# EAGLE design lp50xx-breakout (EAGLE 9.6.2)
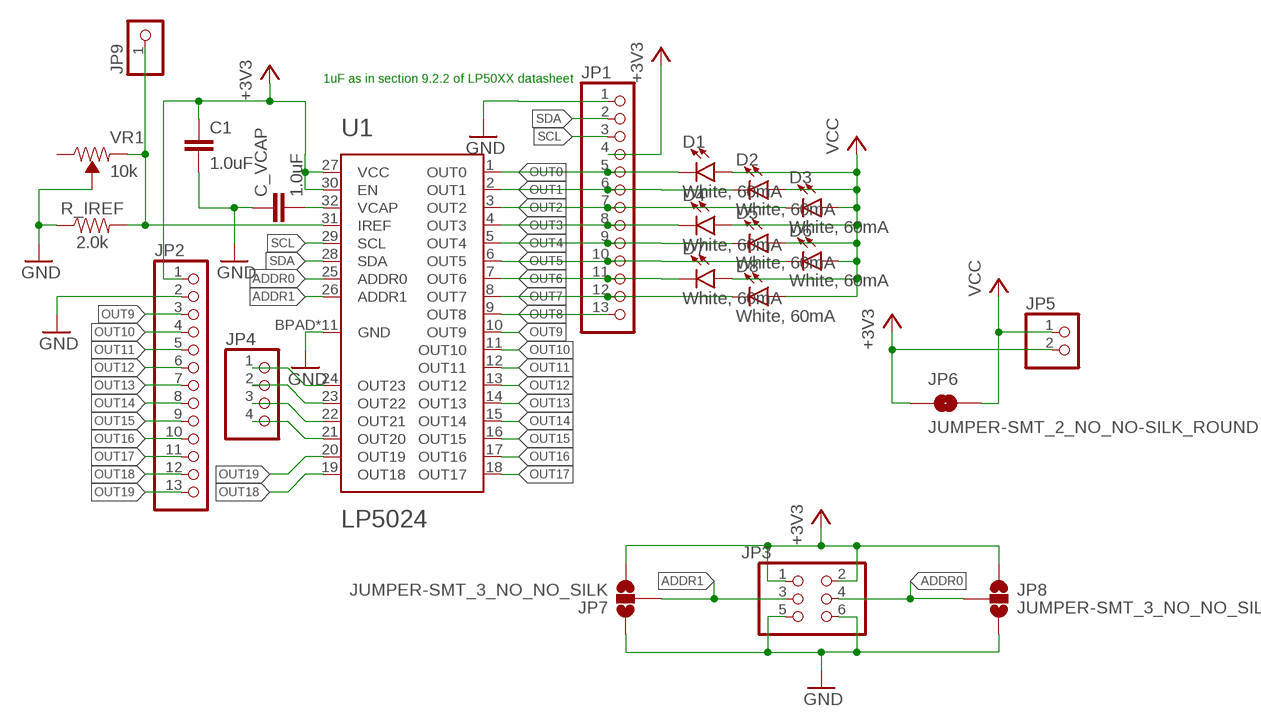
[diagram p0: schematic, sheet 1]

## Parts
C1  1.0uF  1.0UF-0603-16V-10%  [0603]
C_VCAP  1.0uF  1.0UF-0603-16V-10%  [0603]
D1  White, 60mA  LED-WHITE3014  [SUPER_BRIGHT_SMD_LED_3014]
D2  White, 60mA  LED-WHITE3014  [SUPER_BRIGHT_SMD_LED_3014]
D3  White, 60mA  LED-WHITE3014  [SUPER_BRIGHT_SMD_LED_3014]
D4  White, 60mA  LED-WHITE3014  [SUPER_BRIGHT_SMD_LED_3014]
D5  White, 60mA  LED-WHITE3014  [SUPER_BRIGHT_SMD_LED_3014]
D6  White, 60mA  LED-WHITE3014  [SUPER_BRIGHT_SMD_LED_3014]
D7  White, 60mA  LED-WHITE3014  [SUPER_BRIGHT_SMD_LED_3014]
D8  White, 60mA  LED-WHITE3014  [SUPER_BRIGHT_SMD_LED_3014]
JP1  PINHD-1X13  [1X13]
JP2  PINHD-1X13  [1X13]
JP3  PINHD-2X3  [2X03]
JP4  PINHD-1X4  [1X04]
JP5  PINHD-1X2  [1X02]
JP6  JUMPER-SMT_2_NO_NO-SILK_ROUND  [SMT-JUMPER_2_NO_NO-SILK_ROUND]
JP7  JUMPER-SMT_3_NO_NO_SILK  [SMT-JUMPER_3_0-NO_TRACE_NO-SILK]
JP8  JUMPER-SMT_3_NO_NO_SILK  [SMT-JUMPER_3_0-NO_TRACE_NO-SILK]
JP9  PINHD-1X1  [1X01]
R_IREF  2.0k  2.0KOHM-0603-1/10W-5%  [0603]
U1  LP5024  [S-PVQFN-N32]
VR1  10k  TRIMPOT-SMD-3MM-CLOSED-1/8W-20%  [TRIMPOT-SMD-3MM-CLOSED]

## Nets
+3V3: C1.1 JP1.4 JP2.1 JP3.1 JP3.2 JP5.2 JP6.1 JP7.3 JP8.1 U1.27(VCC) U1.30(EN)
ADDR0: JP3.4 JP8.2 U1.25(ADDR0)
ADDR1: JP3.3 JP7.2 U1.26(ADDR1)
GND: C1.2 C_VCAP.1 JP1.1 JP2.2 JP3.5 JP3.6 JP7.1 JP8.3 R_IREF.1 U1.BPAD(GND) U1.EVIA@1(GND) U1.EVIA@2(GND) U1.EVIA@3(GND) U1.EVIA@4(GND) U1.EVIA@5(GND) U1.EVIA@6(GND) U1.EVIA@7(GND) U1.EVIA@8(GND) U1.EVIA@9(GND) U1.TPAD(GND) VR1.2(WIPER)
IREF: JP9.1 R_IREF.2 U1.31(IREF) VR1.1(CCW)
OUT0: D1.C JP1.5 U1.1(OUT0)
OUT1: D2.C JP1.6 U1.2(OUT1)
OUT2: D3.C JP1.7 U1.3(OUT2)
OUT3: D4.C JP1.8 U1.4(OUT3)
OUT4: D5.C JP1.9 U1.5(OUT4)
OUT5: D6.C JP1.10 U1.6(OUT5)
OUT6: D7.C JP1.11 U1.7(OUT6)
OUT7: D8.C JP1.12 U1.8(OUT7)
OUT8: JP1.13 U1.9(OUT8)
OUT9: JP2.3 U1.10(OUT9)
OUT10: JP2.4 U1.11(OUT10)
OUT11: JP2.5 U1.12(OUT11)
OUT12: JP2.6 U1.13(OUT12)
OUT13: JP2.7 U1.14(OUT13)
OUT14: JP2.8 U1.15(OUT14)
OUT15: JP2.9 U1.16(OUT15)
OUT16: JP2.10 U1.17(OUT16)
OUT17: JP2.11 U1.18(OUT17)
OUT18: JP2.12 U1.19(OUT18)
OUT19: JP2.13 U1.20(OUT19)
OUT20: JP4.4 U1.21(OUT20)
OUT21: JP4.3 U1.22(OUT21)
OUT22: JP4.2 U1.23(OUT22)
OUT23: JP4.1 U1.24(OUT23)
SCL: JP1.3 U1.29(SCL)
SDA: JP1.2 U1.28(SDA)
VCAP: C_VCAP.2 U1.32(VCAP)
VCC: D1.A D2.A D3.A D4.A D5.A D6.A D7.A D8.A JP5.1 JP6.2
Unconnected: VR1.3(CW)

## Notes on the sheet
- 1uF as in section 9.2.2 of LP50XX datasheet

## Library data of the parts
C1 C_VCAP = SparkFun-Capacitors:1.0UF: 1µF ceramic capacitors A capacitor is a passive two-terminal electrical component used to store electrical energy temporarily in an electric field.; PROD_ID: CAP-00868
D1-D8 = SparkFun-LED-otto:LED-WHITE: White SMD LED Used in manufacturing several products at SparkFun. Packages: 0603 - Bright White SMD 0603 package[Product Link] <http://www.kingbrightusa.com/product.asp?catalog_name=LED&product_id=APT1608QWF/D> 1206 - Bright White SMD1206 package [Product Link] <http://www.kingbrightusa.com/product.asp?catalog_name=LED&product_id=APT3216QWF/D> 3014 - Super Bright SMD 3014 package [Datasheet] <http://www.lumileds.com/uploads/459/DS208-pdf> SparkFun Products: Blackberry Trackballer Breakout <https://www.sparkfun.com/products/13169> Digital SandBox <https://www.sparkfun.com/products/12651>; PROD_ID: DIO-13728
JP1 JP2 = pinhead-otto:PINHD-1X13: PIN HEADER
JP3 = pinhead-otto:PINHD-2X3: PIN HEADER
JP4 = pinhead-otto:PINHD-1X4: PIN HEADER
JP5 = pinhead-otto:PINHD-1X2: PIN HEADER
JP6 = SparkFun-Jumpers:JUMPER-SMT_2_NO: Normally open jumper This jumper has two pads in close proximity to each other. Apply solder to close the connection. Round pads are easier to solder for beginners, but are a lot larger. SparkFun Product that uses the round pads: SparkFun EL Sequencer <https://www.sparkfun.com/products/12781>
JP7 JP8 = SparkFun-Jumpers:JUMPER-SMT_3_NO: Normally open jumper This jumper has three pads in close proximity to each other. Apply solder to close the connection(s).
JP9 = pinhead-otto:PINHD-1X1: PIN HEADER
R_IREF = SparkFun-Resistors:2.0KOHM: 2kΩ resistor A resistor is a passive two-terminal electrical component that implements electrical resistance as a circuit element. Resistors act to reduce current flow, and, at the same time, act to lower voltage levels within circuits. - Wikipedia; PROD_ID: RES-08296
U1 = lp50xx:LP5024
VR1 = SparkFun-Resistors:TRIMPOT: Trimming Potentiometer (Trimpot) Three-terminal potentiometers, with an adjustable wiper and two adjustable resistors. A pot can be used to create a configurable voltage divider, or as a variable resistor. "Trimpots" are a subset of potentiometers, usually intended for "set-and-forget" applications. They're often more delicate than standard potentiometers - rated for fewer turns. Variants PTH-KNOB - PTH Trimpot w/ finger-adjustable knob Trimpot 10K with Knob <https://www.sparkfun.com/products/9806> (COM-09806) Datasheet <http://www.sparkfun.com/datasheets/Components/General/TSR-3386.pdf> SMD-3MM-CLOSED-FRAME - SMD 3mm Square Closed-Frame Trimpot Used on e.g. EasyDriver - Stepper Motor Driver <https://www.sparkfun.com/products/12779> Datasheet <http://www.bitechnologies.com/pdfs/22.pdf> (22AR10KTR) SMD-5MM - SMD 5mm Square Closed-Frame Trimpot Used on e.g. IOIO-OTG - V2.2 <https://www.sparkfun.com/products/13613> Datasheet <http://www.vishay.com/docs/51008/ts53.pdf> (TS53YL502MR10) SMD-3MM-1/10W-25% - 3mm Square Open-Frame Trimpot Used on e.g. SparkFun Shapeoko <https://www.sparkfun.com/products/13899> Datasheet <http://www.bourns.com/docs/Product-Datasheets/TC33.pdf> (TC33X-2-103E); PROD_ID: RES-09285

## Net classes
0 default: clearance 0.205 mm

## Board
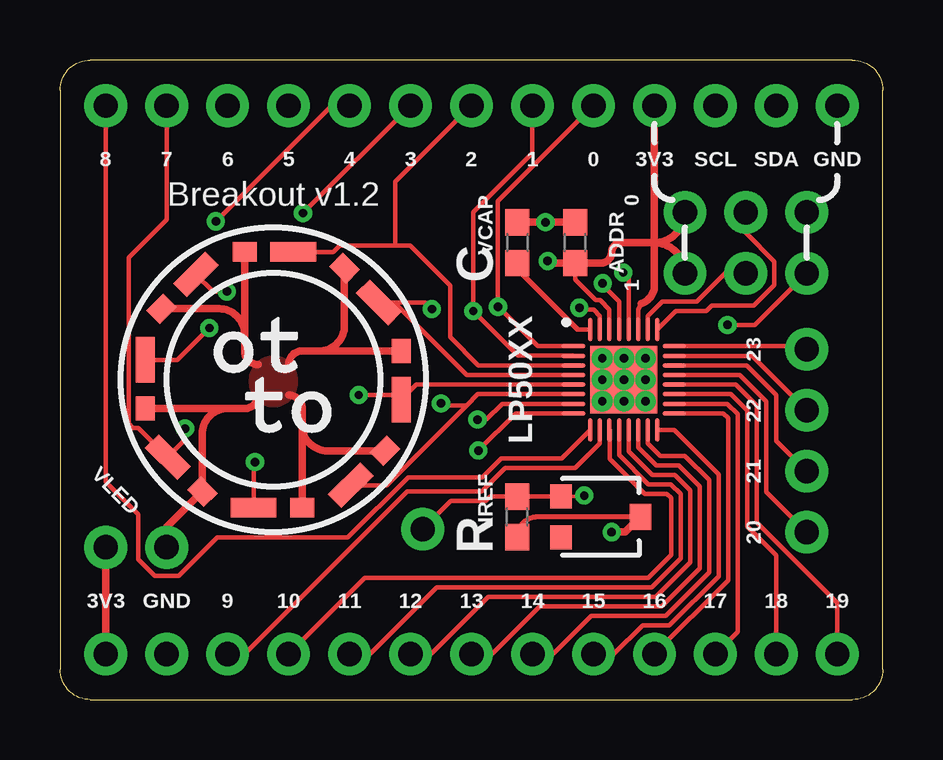
[diagram p1: board, top side]
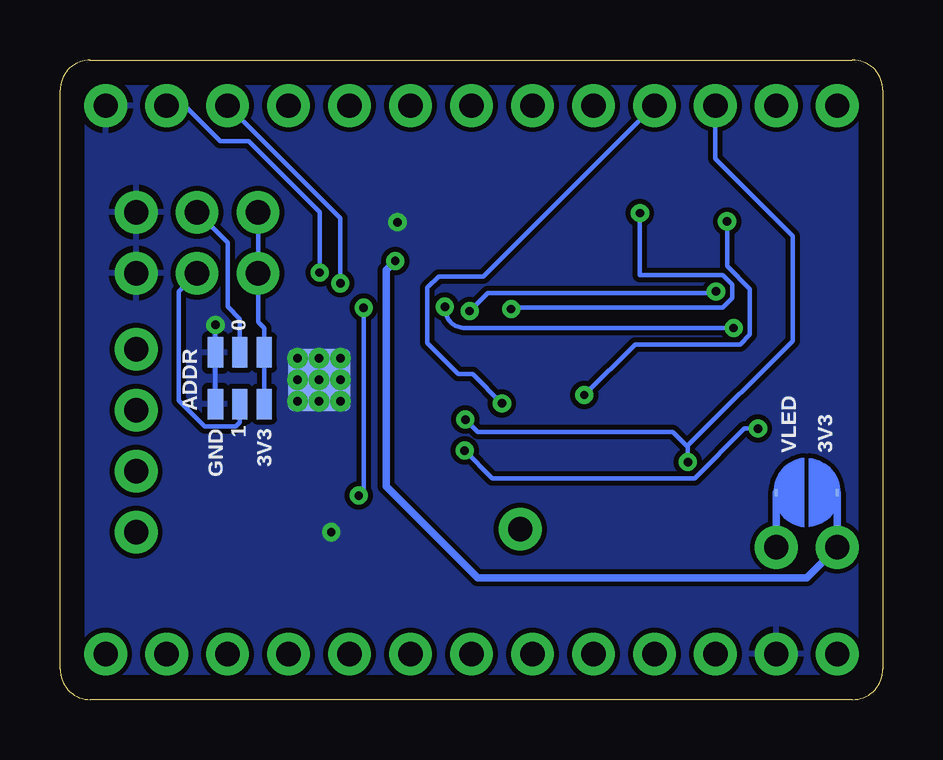
[diagram p2: board, bottom side, seen from below]

Size 34.29 x 26.67 mm. Coordinates in mm from the lower left corner, seen from the top.
Outline: 1.27,0 33.02,0 arc90 34.29,1.27 34.29,25.4 arc90 33.02,26.67 1.27,26.67 arc90 0,25.4 0,1.27 arc90 1.27,0
Copper layers (1*16): Top 0.035mm / dielectric 1.5mm / Bottom 0.035mm
Design rules "default *": minimum track width 6mil, minimum drill 0.3mm, track to track 6mil, track to pad 6mil, pad to pad 6mil, via to via 6mil, smd to smd 0mil, copper to edge 40mil, drill to drill 6mil, minimum pad ring 10mil, minimum via ring 8mil, stop-mask expansion 4mil, vias tented up to drill 15mil, thermal gap 10mil

### Footprints (pad centres in the part's own frame; a part is rotated, then mirrored left to right if it is on the bottom)
0603 = smd 1.1 x 1: 1 -0.85,0; 2 0.85,0
SUPER_BRIGHT_SMD_LED_3014 = smd 1 x 0.8: A -1.2,0 | smd 1.9 x 0.8: C 0.827,0
1X13 = drill 1.016 pad 1.778: 1 -15.24,0; 2 -12.7,0; 3 -10.16,0; 4 -7.62,0; 5 -5.08,0; 6 -2.54,0; 7 0,0; 8 2.54,0; 9 5.08,0; 10 7.62,0; 11 10.16,0; 12 12.7,0; 13 15.24,0
2X03 = drill 1.016 pad 1.778: 1 -2.54,-1.27; 2 -2.54,1.27; 3 0,-1.27; 4 0,1.27; 5 2.54,-1.27; 6 2.54,1.27
1X04 = drill 1.016 pad 1.778: 1 -3.81,0; 2 -1.27,0; 3 1.27,0; 4 3.81,0
1X02 = drill 1.016 pad 1.778: 1 -1.27,0; 2 1.27,0
SMT-JUMPER_2_NO_NO-SILK_ROUND = smd 0.152 x 0.305: 1 -1.27,0; 2 1.27,0
SMT-JUMPER_3_0-NO_TRACE_NO-SILK = smd 0.635 x 1.27: 1 -1.016,0; 2 0,0; 3 1.016,0
1X01 = drill 1.016 pad 1.778: 1 0,0
S-PVQFN-N32 = smd 0.195 x 0.99: 1 -1.4,-2.1; 2 -1,-2.1; 3 -0.6,-2.1; 4 -0.2,-2.1; 5 0.2,-2.1; 6 0.6,-2.1; 7 1,-2.1; 8 1.4,-2.1; 17 1.4,2.1; 18 1,2.1; 19 0.6,2.1; 20 0.2,2.1; 21 -0.2,2.1; 22 -0.6,2.1; 23 -1,2.1; 24 -1.4,2.1 | smd 0.99 x 0.195: 9 2.1,-1.4; 10 2.1,-1; 11 2.1,-0.6; 12 2.1,-0.2; 13 2.1,0.2; 14 2.1,0.6; 15 2.1,1; 16 2.1,1.4; 25 -2.1,1.4; 26 -2.1,1; 27 -2.1,0.6; 28 -2.1,0.2; 29 -2.1,-0.2; 30 -2.1,-0.6; 31 -2.1,-1; 32 -2.1,-1.4 | smd 2.6 x 2.6 bottom: BPAD 0,0 | drill 0.35 pad 0.6: EVIA@1 -0.9,0.9; EVIA@2 0,0.9; EVIA@3 0.9,0.9; EVIA@4 -0.9,0; EVIA@5 0,0; EVIA@6 0.9,0; EVIA@7 -0.9,-0.9; EVIA@8 0,-0.9; EVIA@9 0.9,-0.9 | smd 2.8 x 2.8: TPAD 0,0
TRIMPOT-SMD-3MM-CLOSED = smd 1 x 0.9: 1 -0.85,-1.65; 3 0.85,-1.65 | smd 1.1 x 0.9: 2 0,1.65

### Placement (x,y rotation side)
C1  21.46,19.05 90 top
C_VCAP  19.05,19.05 270 top
D1  3.56,13.34 90 top
D2  5.08,17.14 45 top
D3  8.89,18.67 0 top
D4  12.7,17.14 315 top
D5  14.22,13.34 270 top
D6  12.7,9.53 225 top
D7  8.89,8 180 top
D8  5.08,9.53 135 top
JP1  17.14,24.77 180 top
JP2  17.14,1.91 0 top
JP3  28.57,19.05 0 top
JP4  31.11,10.79 270 top
JP5  3.17,6.35 180 top
JP6  3.17,8.64 180 bottom
JP7  26.8,12.32 0 bottom
JP8  26.8,14.48 180 bottom
JP9  15.11,7.11 0 top
R_IREF  19.05,7.62 90 top
U1  23.49,13.34 270 top
VR1  22.53,7.62 270 top

### Tracks (layer width: path | path; a pad name or v marks a point on that pad's centre or on a via)
+3V3  (via drill 0.35)
  Top 0.191: U1.30 22.89,16.27 22.51,16.66 22.33,16.66 21.46,17.52 C1.1 | U1.27 24.09,16.26 24.22,16.51
  Top 0.305: JP2.1 JP5.2 | JP3.2 arc-90 24.77,19.05 | 24.77,19.05 arc-90 JP3.1 | 24.77,19.05 23.37,19.05 arc90 22.99,18.67 arc-90 22.52,18.2 C1.1 20.41,18.2 v20.32,18.29 | JP1.4 24.77,19.05 | 24.77,19.05 24.77,17.27 arc-71 24.22,16.51
  Bottom 0.191: JP3.2 JP3.1 26.04,15.75 25.78,15.49 JP8.1 JP7.3
  Bottom 0.305: v20.32,18.29 20.7,17.91 20.7,8.89 16.89,5.08 3.17,5.08 JP5.2 JP6.1
ADDR0
  Top 0.191: U1.25 25.65,16.2 26.92,16.2 27.15,16.43 28.9,16.43 29.76,17.29 29.76,18.27 28.57,19.46 JP3.4
  Bottom 0.191: JP8.2 26.8,15.88 27.3,16.38 27.3,19.05 JP3.4
ADDR1
  Top 0.191: U1.26 24.5,16 25.09,16.59 26.53,16.59 27.72,17.78 JP3.3
  Bottom 0.191: 26.81,12.7 26.81,12.34 JP7.2 26.8,11.56 26.97,11.38 28.25,11.38 29.34,12.47 29.34,17.02 JP3.3
GND  (via drill 0.35)
  Top 0.191: JP3.5 28.96,15.62 v27.81,15.62
  Top 0.203: VR1.2 19.9,7.62 arc90 R_IREF.1
  Top 0.305: VR1.2 23.54,6.99 v22.99,6.99 | C_VCAP.1 v20.22,19.9 v20.23,19.9 C1.2
  Bottom 0.191: JP7.1 JP8.3 v27.81,15.62
  pour Bottom: -0.63,-0.64 -0.63,27.3 34.92,27.3 34.92,-0.64
IREF  (via drill 0.35)
  Top 0.152: U1.31 22.47,15.46 | v21.84,8.51 21.8,8.47 VR1.1
  Top 0.191: U1.31 22.49,15.99 22.23,16.26 21.72,16.26 v21.64,16.34 | JP9.1 16.29,8.29 17.74,8.29 17.92,8.47 R_IREF.2 VR1.1
  Bottom 0.152: 21.64,8.71 v21.84,8.51
  Bottom 0.191: v21.64,16.34 21.64,8.71
OUT0  (via drill 0.35)
  Top 0.191: JP1.5 18.25,20.79 v18.25,16.38 19.9,14.73 U1.1 | D1.C 4.89,14.16 v6.22,15.49
  Bottom 0.191: v6.22,15.49 17.42,15.49 arc90 18.25,16.33 v18.25,16.38
OUT1  (via drill 0.35)
  Top 0.191: JP1.6 19.68,22.78 17.22,20.32 v17.22,16.2 19.08,14.34 U1.2 | 5.67,17.83 D2.C 6.38,17.02 v6.95,17.02
  Bottom 0.191: v17.22,16.2 16.46,16.96 7.01,16.96 v6.95,17.02
OUT2
  Top 0.191: 9.53,18.48 D3.C 11.39,18.67 11.66,18.93 13.97,18.93 | U1.3 17.43,13.94 16.26,15.11 16.26,17.27 14.6,18.93 13.97,18.93 | JP1.7 13.97,21.59 13.97,18.93
OUT3  (via drill 0.35)
  Top 0.191: U1.4 16.95,13.54 13.92,16.56 | 13.92,16.56 D4.C | 13.92,16.56 15.22,16.56 v15.49,16.28 | v10.12,20.29 JP1.8
  Bottom 0.191: v10.12,20.29 10.12,17.69 6.67,17.69 6.28,17.3 6.28,16.73 6.67,16.34 15.44,16.34 v15.49,16.28
OUT4  (via drill 0.35)
  Top 0.191: U1.5 14.85,13.13 D5.C 14.03,12.7 v12.45,12.7 | JP1.9 11.32,24.77 v6.5,19.94
  Bottom 0.191: v12.45,12.7 10.33,14.82 5.94,14.82 5.54,15.21 5.54,17.12 6.5,18.08 v6.5,19.94
OUT5  (via drill 0.35)
  Top 0.191: U1.6 17.41,12.73 16.94,12.27 | 16.94,12.27 13.61,8.94 D6.C | 16.94,12.27 15.96,12.27 v15.88,12.35
  Bottom 0.191: v15.88,12.35 17.1,13.57 17.69,13.57 18.99,14.87 18.99,17.17 18.52,17.64 16.65,17.64 JP1.10
OUT6  (via drill 0.35)
  Top 0.191: D7.C 8.06,9.84 v8.13,9.91 | U1.7 18.42,12.33 17.76,11.68 v17.4,11.68
  Bottom 0.191: v8.13,9.91 8.13,10.54 | 8.13,10.54 8.13,10.6 3.77,14.96 3.77,19.33 6.99,22.55 JP1.11 | v17.4,11.68 16.89,11.17 8.75,11.17 8.13,10.54
OUT7  (via drill 0.35)
  Top 0.191: JP1.12 4.45,20.01 2.86,18.42 2.86,11.51 3.03,11.34 3.27,11.34 D8.C 5.21,10.82 v5.21,11.3 | U1.8 18.98,11.94 v17.43,10.38
  Bottom 0.191: v5.21,11.3 5.77,11.3 7.85,9.23 16.27,9.23 v17.43,10.38
OUT8
  Top 0.191: U1.9 20.91,10.05 18.38,10.05 17.6,9.27 14.5,9.27 12,6.76 6.54,6.76 4.94,5.16 3.95,5.16 3.26,5.86 3.26,7.72 1.91,9.07 JP1.13
OUT9
  Top 0.191: U1.10 22.49,10.67 21.47,9.65 18.54,9.65 17.57,8.68 14.47,8.68 7.7,1.91 JP2.3
OUT10
  Top 0.191: U1.11 22.9,10.04 24.36,8.58 25.29,8.58 25.46,8.4 25.46,6.04 24.51,5.08 12.7,5.08 JP2.4
OUT11
  Top 0.191: U1.12 23.3,10.2 24.52,8.97 25.45,8.97 25.86,8.57 25.86,5.88 24.66,4.68 15.69,4.68 12.92,1.91 JP2.5
OUT12
  Top 0.191: U1.13 23.7,10.35 24.68,9.37 25.62,9.37 26.25,8.73 26.25,5.71 24.82,4.28 17.84,4.28 15.46,1.91 JP2.6
OUT13
  Top 0.191: U1.14 24.1,10.51 24.85,9.76 25.78,9.76 26.65,8.9 26.65,5.47 25.07,3.88 19.98,3.88 18,1.91 JP2.7
OUT14
  Top 0.191: U1.15 24.5,10.67 25.01,10.16 26.04,10.16 27.04,9.15 27.04,5.3 25.23,3.49 22.13,3.49 20.54,1.91 JP2.8
OUT15
  Top 0.191: U1.16 25.59,11.23 27.44,9.39 27.44,5.14 25.39,3.09 24.27,3.09 23.08,1.91 JP2.9
OUT16
  Top 0.191: U1.17 27.64,11.94 27.84,11.74 27.84,4.98 JP2.10
OUT17
  Top 0.191: U1.18 27.8,12.34 28.23,11.9 28.23,2.83 JP2.11
OUT18
  Top 0.191: U1.19 27.96,12.73 28.63,12.06 28.63,7.23 29.84,6.01 JP2.12
OUT19
  Top 0.191: U1.20 28.15,13.13 29.02,12.27 29.02,7.4 32.38,4.03 JP2.13
OUT20
  Top 0.191: U1.21 28.32,13.53 29.42,12.43 29.42,8.65 31.08,6.99 JP4.4
OUT21
  Top 0.191: U1.22 28.61,13.94 29.84,12.7 29.84,10.79 JP4.3
OUT22
  Top 0.191: U1.23 28.84,14.34 JP4.2
OUT23
  Top 0.191: U1.24 30.98,14.73 JP4.1
SCL  (via drill 0.35)
  Top 0.152: v22.61,17.36 22.61,17.29
  Top 0.191: U1.29 23.29,16.6 22.61,17.29
  Bottom 0.191: v22.61,17.36 22.61,20.07 JP1.3
SDA  (via drill 0.35)
  Top 0.191: U1.28 23.7,17.58 v23.47,17.81
  Bottom 0.191: JP1.2 29.08,24.77 27.61,23.29 26.43,23.29 23.47,20.33 v23.47,17.81
VCAP
  Top 0.191: 21.57,15.44 U1.32
  Top 0.203: 21.57,15.44 19.05,17.96 C_VCAP.2
VCC
  Top 0.305: D3.A 7.69,15.24 | 7.69,15.24 7.69,14.54 arc90 8.25,13.97 | D7.A 10.09,11.43 | 10.09,11.43 10.09,12.13 arc90 9.53,12.7 | D5.A 10.8,14.54 | 10.8,14.54 10.09,14.54 arc90 9.53,13.97 | D1.A 6.99,12.13 | 6.99,12.13 7.69,12.13 arc90 8.25,12.7 | D2.A 6.63,16.3 arc-90 7.69,15.24 | D4.A 11.85,15.59 arc-90 10.8,14.54 | D6.A 11.15,10.37 arc-90 10.09,11.43 | 6.99,12.13 arc90 5.93,11.08 D8.A 4.45,7.19 JP5.1
  Bottom 0.305: JP6.2 JP5.1
  pour Top: 8.89,14.35 arc90 7.87,13.34 7.87,13.21 arc90 8.89,12.19 arc90 9.91,13.21 9.91,13.34 arc90

### Text on the board
tPlace: Breakout v1.2
tNames: 8 | 7 | 6 | 5 | 4 | 3 | 2 | 1 | 0 | 3V3 | SCL | SDA | GND | 0 | VCAP | ADDR | C | 1 | 23 | LP50XX | 22 | 21 | VLED | IREF | 20 | R | 3V3 | GND | 9 | 10 | 11 | 12 | 13 | 14 | 15 | 16 | 17 | 18 | 19
bNames: 0 | ADDR | 3V3 | 1 | GND | 3V3 | VLED